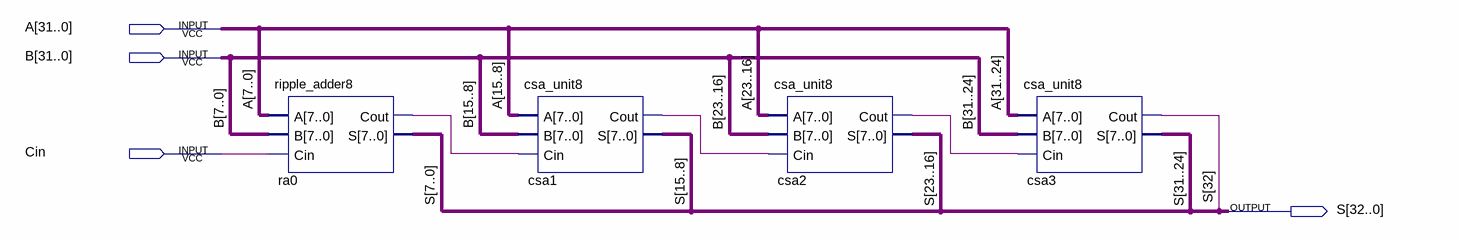
[diagram p0: schematic sheet]
// Quartus schematic csa32.bdf as structural Verilog: 4 symbols, 4 pins
module csa32 (
  input  [31:0] A,
  input  [31:0] B,
  input  Cin,
  output [32:0] S
);

  wire csa1_cout, csa2_cout, ra0_cout;

  ripple_adder8 ra0 (.A(A[7:0]), .B(B[7:0]), .Cin(Cin), .Cout(ra0_cout), .S(S[7:0]));
  csa_unit8 csa1 (.A(A[15:8]), .B(B[15:8]), .Cin(ra0_cout), .Cout(csa1_cout), .S(S[15:8]));
  csa_unit8 csa2 (.A(A[23:16]), .B(B[23:16]), .Cin(csa1_cout), .Cout(csa2_cout), .S(S[23:16]));
  csa_unit8 csa3 (.A(A[31:24]), .B(B[31:24]), .Cin(csa2_cout), .Cout(S[32]), .S(S[31:24]));
endmodule
